# Altium schematic sheet EDF.SchDoc
size A4
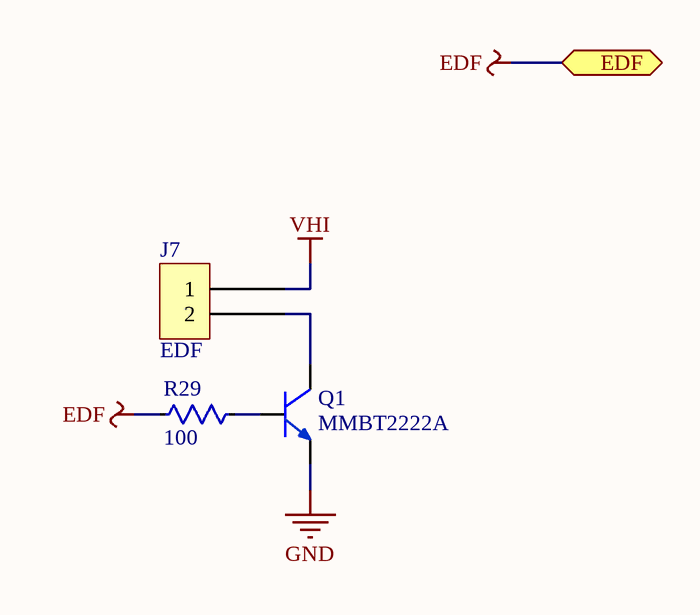
[diagram p0: EDF.SchDoc]

## Parts
J7  EDF  [HEADER 1x2]
Q1  MMBT2222A  [SOT-23]
R29  value 100  [R1206]  (hidden comment: RES)

## Ports
EDF

## Nets
EDF: R29.1 ; port EDF
GND: Q1.E
VHI: J7.1
NetJ7_2: J7.2 Q1.C
NetQ1_B: Q1.B R29.2

## Library data of the parts
J7 = Header 1x2
Q1 = NPN